# EAGLE design altimetrModul (EAGLE 9.6.2)
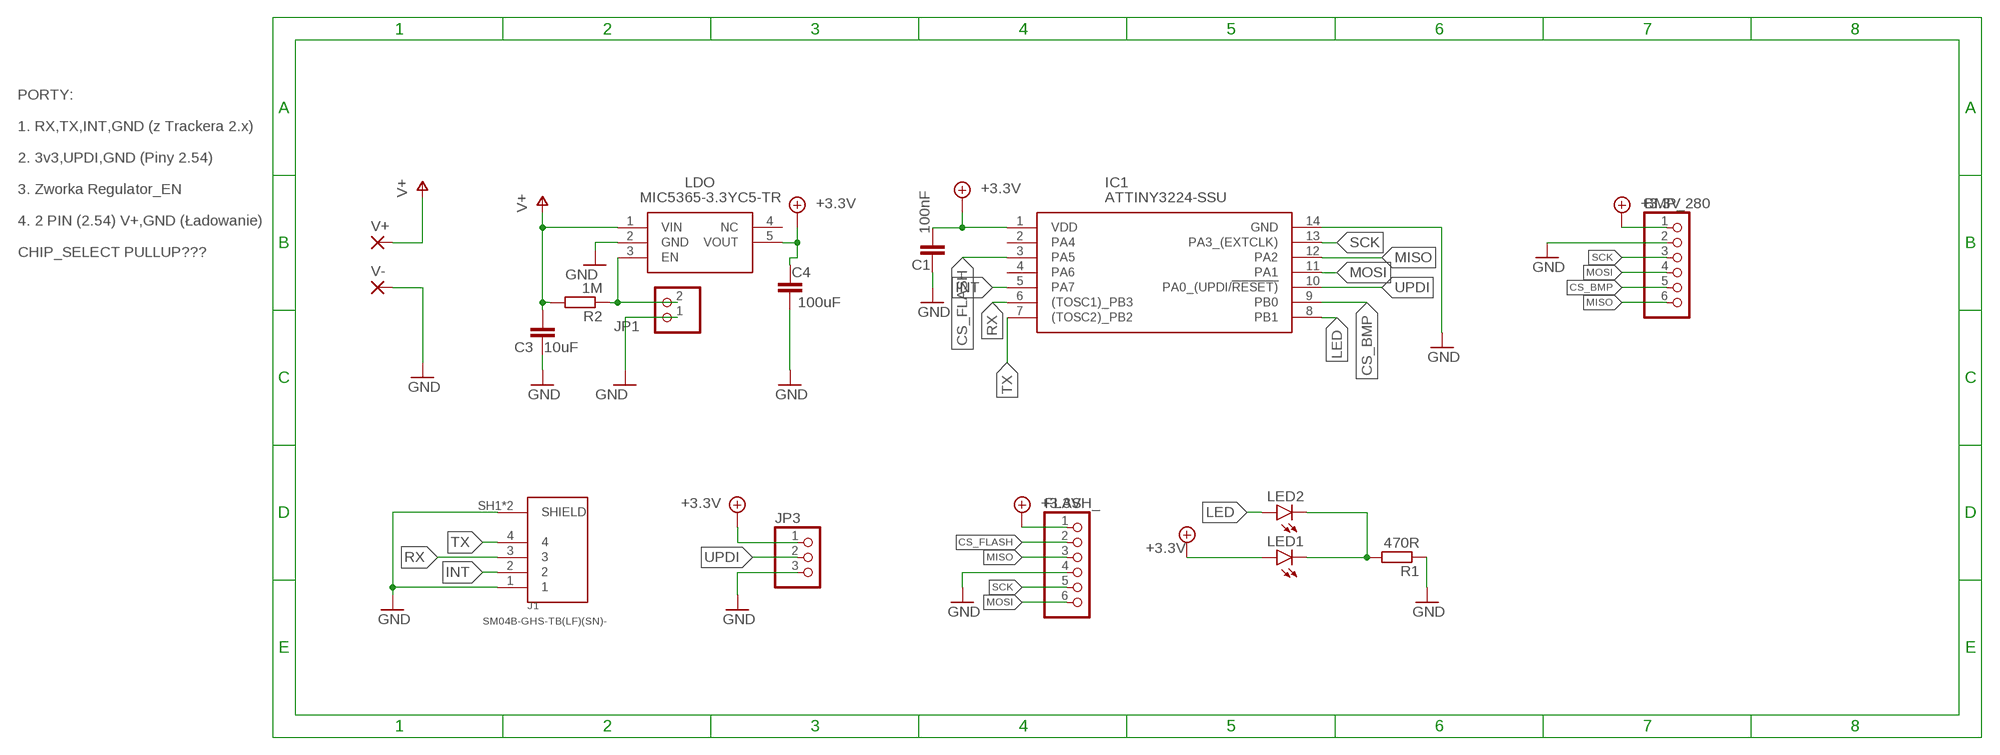
[diagram p0: schematic, sheet 1]

## Parts
BMP_280  PINHD-1X6  [1X06]
C1  100nF  C-EUC0805  [C0805]
C3  10uF  C-EUC0805  [C0805]
C4  100uF  C-EUC0805  [C0805]
FLASH_  PINHD-1X6  [1X06]
IC1  ATTINY3224-SSU  [SOIC127P600X175-14N]
J1  SM04B-GHS-TB(LF)(SN)-  [JST_SM04B-GHS-TB(LF)(SN)-]
JP1  PINHD-1X2/90  [1X02/90]
JP3  PINHD-1X3/90  [1X03/90]
LDO  MIC5365-3.3YC5-TR  [SOT65P210X110-5N]
LED1  LEDCHIP-LED0805  [CHIP-LED0805]
LED2  LEDCHIP-LED0805  [CHIP-LED0805]
R1  470R  R-EU_R0805  [R0805]
R2  1M  R-EU_R0805  [R0805]
V+  SMD2  [SMD1,27-2,54]
V-  SMD2  [SMD1,27-2,54]

## Nets
+3.3V: BMP_280.1 C1.1 C4.2 FLASH_.1 IC1.1(VDD) JP3.1 LDO.5(VOUT) LED1.A
CS_BMP: BMP_280.5 IC1.9(PB0)
CS_FLASH: FLASH_.2 IC1.3(PA5)
EN: JP1.2 LDO.3(EN) R2.1
GND: BMP_280.2 C1.2 C3.1 C4.1 FLASH_.4 IC1.14(GND) J1.1 J1.SH1(SHIELD) J1.SH2(SHIELD) JP1.1 JP3.3 LDO.2(GND) R1.1 V-.1(P)
INT: IC1.5(PA7) J1.2
LED: IC1.8(PB1) LED2.A
MISO: BMP_280.6 FLASH_.3 IC1.12(PA2)
MOSI: BMP_280.4 FLASH_.6 IC1.11(PA1)
N$14: LED1.C LED2.C R1.2
RX: IC1.6((TOSC1)_PB3) J1.3
SCK: BMP_280.3 FLASH_.5 IC1.13(PA3_(EXTCLK))
TX: IC1.7((TOSC2)_PB2) J1.4
UPDI: IC1.10(PA0_(UPDI/!RESET)) JP3.2
V+: C3.2 LDO.1(VIN) R2.2 V+.1(P)
Unconnected: IC1.2(PA4) IC1.4(PA6) LDO.4(NC)

## Notes on the sheet
- PORTY:
  
  1. RX,TX,INT,GND (z Trackera 2.x)
  
  2. 3v3,UPDI,GND (Piny 2.54)
  
  3. Zworka Regulator_EN
  
  4. 2 PIN (2.54) V+,GND (Ładowanie)
  
  CHIP_SELECT PULLUP???

## Library data of the parts
BMP_280 FLASH_ = pinhead:PINHD-1X6: PIN HEADER
C1 C3 C4 = rcl:C-EU: CAPACITOR, European symbol; SPICEPREFIX: C
IC1 = ATTINY3224-SSU:ATTINY3224-SSU: 8-bit Microcontrollers - MCU 20MHz, 32KB, SOIC14, Ind 85C, Green Source: Datasheet <https://ww1.microchip.com/downloads/aemDocuments/documents/MCU08/ProductDocuments/DataSheets/ATtiny3224-3226-3227-Data-Sheet-DS40002345B.pdf>; ARROW_PART_NUMBER: ATTINY3224-SSU; ARROW_PRICE-STOCK: https://www.arrow.com/en/products/attiny3224-ssu/microchip-technology?region=nac; DESCRIPTION: 8-bit Microcontrollers - MCU 20MHz, 32KB, SOIC14, Ind 85C, Green; HEIGHT: 1.75mm; MANUFACTURER_NAME: Microchip; MANUFACTURER_PART_NUMBER: ATTINY3224-SSU; MOUSER_PART_NUMBER: 579-ATTINY3224-SSU; MOUSER_PRICE-STOCK: https://www.mouser.co.uk/ProductDetail/Microchip-Technology-Atmel/ATTINY3224-SSU?qs=A6eO%252BMLsxmTXlQkMmf%252B9gw%3D%3D
J1 = PUTRocketLab_connectors:SM04B-GHS-TB(LF)(SN)-: Conn Header Gh Side 4pos 1.25mm; DESCRIPTION: Connector Header Surface Mount, Right Angle 4 position 0.049 (1.25mm); DIGI-KEY_PART_NUMBER: 455-1566-6-ND; MF: JST Sales; MP: SM04B-GHS-TB(LF)(SN)-; PACKAGE: None; PURCHASE-URL: https://pricing.snapeda.com/search/part/SM04B-GHS-TB(LF)(SN)-/?ref=eda
JP1 = pinhead:PINHD-1X2: PIN HEADER
JP3 = pinhead:PINHD-1X3: PIN HEADER
LDO = MIC5365-3.3YC5-TR:MIC5365-3.3YC5-TR: MICROCHIP - MIC5365-3.3YC5-TR - LDO, FIXED, 3.3V, 0.15A, SC-70-5 Source: Datasheet <http://www.mouser.com/ds/2/268/mic5365-779177.pdf>; ARROW_PART_NUMBER: MIC5365-3.3YC5-TR; ARROW_PRICE-STOCK: https://www.arrow.com/en/products/mic5365-3.3yc5-tr/microchip-technology?region=nac; DESCRIPTION: MICROCHIP - MIC5365-3.3YC5-TR - LDO, FIXED, 3.3V, 0.15A, SC-70-5; HEIGHT: 1.1mm; MANUFACTURER_NAME: Microchip; MANUFACTURER_PART_NUMBER: MIC5365-3.3YC5-TR; MOUSER_PART_NUMBER: 998-MIC5365-3.3YC5TR; MOUSER_PRICE-STOCK: https://www.mouser.co.uk/ProductDetail/Microchip-Technology-Micrel/MIC5365-33YC5-TR?qs=U6T8BxXiZAXvJj%252BPZ%252B301w%3D%3D
LED1 LED2 = led:LED: LED OSRAM: - CHIPLED LG R971, LG N971, LY N971, LG Q971, LY Q971, LO R971, LY R971 LH N974, LH R974 LS Q976, LO Q976, LY Q976 LO Q996 - Hyper CHIPLED LW Q18S LB Q993, LB Q99A, LB R99A - SideLED LS A670, LO A670, LY A670, LG A670, LP A670 LB A673, LV A673, LT A673, LW A673 LH A674 LY A675 LS A676, LA A676, LO A676, LY A676, LW A676 LS A679, LY A679, LG A679 - Hyper Micro SIDELED® LS Y876, LA Y876, LO Y876, LY Y876 LT Y87S - SmartLED LW L88C, LW L88S LB L89C, LB L89S, LG L890 LS L89K, LO L89K, LY L89K LS L896, LA L896, LO L896, LY L896 - TOPLED LS T670, LO T670, LY T670, LG T670, LP T670 LSG T670, LSP T670, LSY T670, LOP T670, LYG T670 LG T671, LOG T671, LSG T671 LB T673, LV T673, LT T673, LW T673 LH T674 LS T676, LA T676, LO T676, LY T676, LB T676, LH T676, LSB T676, LW T676 LB T67C, LV T67C, LT T67C, LS T67K, LO T67K, LY T67K, LW E67C LS E67B, LA E67B, LO E67B, LY E67B, LB E67C, LV E67C, LT E67C LW T67C LS T679, LY T679, LG T679 LS T770, LO T770, LY T770, LG T770, LP T770 LB T773, LV T773, LT T773, LW T773 LH T774 LS E675, LA E675, LY E675, LS T675 LS T776, LA T776, LO T776, LY T776, LB T776 LHGB T686 LT T68C, LB T68C - Hyper Mini TOPLED® LB M676 - Mini TOPLED Santana® LG M470 LS M47K, LO M47K, LY M47K Source: http://www.osram.convergy.de LUXEON: - LUMILED® LXK2-PW12-R00, LXK2-PW12-S00, LXK2-PW14-U00, LXK2-PW14-V00 LXK2-PM12-R00, LXK2-PM12-S00, LXK2-PM14-U00 LXK2-PE12-Q00, LXK2-PE12-R00, LXK2-PE12-S00, LXK2-PE14-T00, LXK2-PE14-U00 LXK2-PB12-K00, LXK2-PB12-L00, LXK2-PB12-M00, LXK2-PB14-N00, LXK2-PB14-P00, LXK2-PB14-Q00 LXK2-PR12-L00, LXK2-PR12-M00, LXK2-PR14-Q00, LXK2-PR14-R00 LXK2-PD12-Q00, LXK2-PD12-R00, LXK2-PD12-S00 LXK2-PH12-R00, LXK2-PH12-S00 LXK2-PL12-P00, LXK2-PL12-Q00, LXK2-PL12-R00 Source: www.luxeon.com KINGBRIGHT: KA-3528ASYC Source: www.kingbright.com
R1 = rcl:R-EU_: RESISTOR, European symbol; SPICEPREFIX: R
R2 = PUTRocketLab_RCL:R-EU_: RESISTOR, European symbol; SPICEPREFIX: R
V+ V- = wirepad:SMD2: SMD PAD

## Board
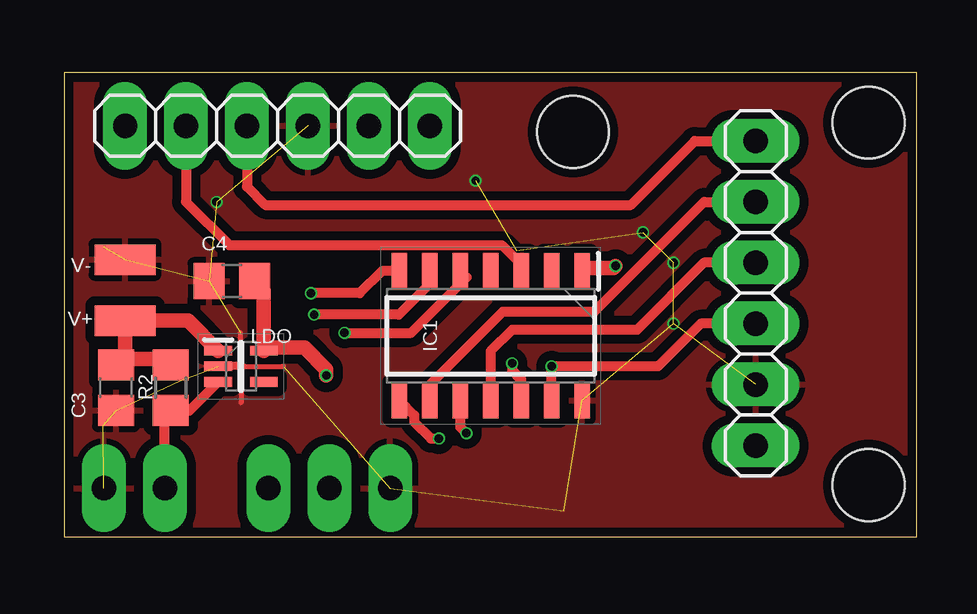
[diagram p1: board, top side]
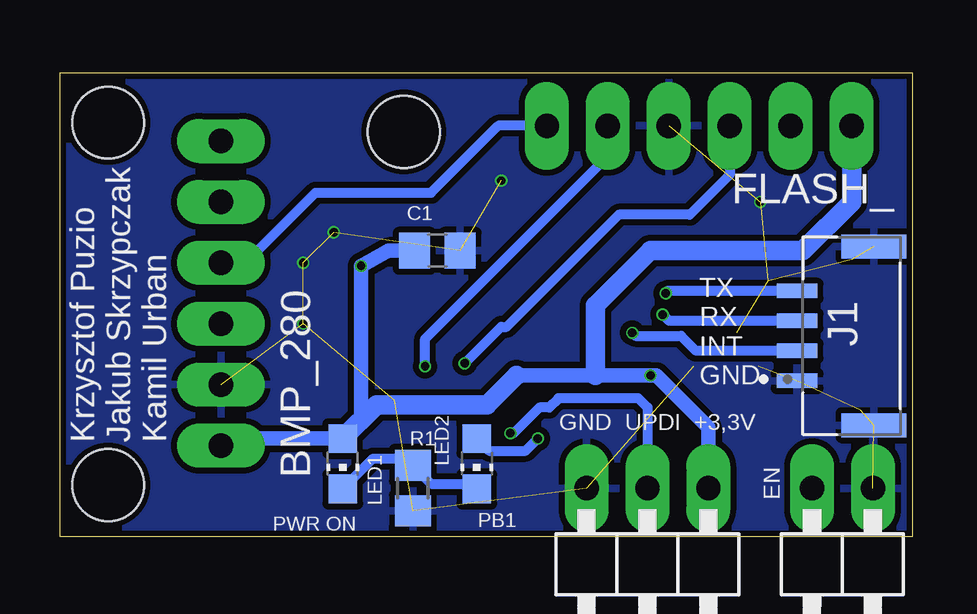
[diagram p2: board, bottom side, seen from below]

Size 35.54 x 19.36 mm. Coordinates in mm from the lower left corner, seen from the top.
Outline: 0,0 35.54,0 35.54,19.36 0,19.36 0,0
Copper layers (1*16): Top 0.035mm / dielectric 1.6mm / Bottom 0.035mm
Design rules "jlcpcb-2layers": minimum track width 5mil, minimum drill 0.3mm, track to track 5mil, track to pad 5mil, pad to pad 5mil, via to via 5mil, smd to smd 5mil, copper to edge 0.2mm, drill to drill 6mil, minimum pad ring 10mil, minimum via ring 3mil, stop-mask expansion 4mil, vias tented up to drill 0mil, thermal gap 10mil
Holes 3 mm at 33.53,17.27 33.53,2.16 21.21,16.89

### Footprints (pad centres in the part's own frame; a part is rotated, then mirrored left to right if it is on the bottom)
1X06 = drill 1.016 long: 1 -6.35,0; 2 -3.81,0; 3 -1.27,0; 4 1.27,0; 5 3.81,0; 6 6.35,0
C0805 = smd 1.3 x 1.5: 1 -0.95,0; 2 0.95,0
SOIC127P600X175-14N = smd 1.5 x 0.65: 1 -2.7,3.81; 2 -2.7,2.54; 3 -2.7,1.27; 4 -2.7,0; 5 -2.7,-1.27; 6 -2.7,-2.54; 7 -2.7,-3.81; 8 2.7,-3.81; 9 2.7,-2.54; 10 2.7,-1.27; 11 2.7,0; 12 2.7,1.27; 13 2.7,2.54; 14 2.7,3.81
JST_SM04B-GHS-TB(LF)(SN)- = smd 0.6 x 1.7: 1 -1.875,2.275; 2 -0.625,2.275; 3 0.625,2.275; 4 1.875,2.275 | smd 1 x 2.7: SH1 -3.725,-0.925; SH2 3.725,-0.925
1X02/90 = drill 1.016 long: 1 -1.27,-3.81; 2 1.27,-3.81
1X03/90 = drill 1.016 long: 1 -2.54,-3.81; 2 0,-3.81; 3 2.54,-3.81
SOT65P210X110-5N = smd 1.15 x 0.4: 1 -0.95,0.65; 2 -0.95,0; 3 -0.95,-0.65; 4 0.95,-0.65; 5 0.95,0.65
CHIP-LED0805 = smd 1.2 x 1.2: A 0,-1.05; C 0,1.05
R0805 = smd 1.3 x 1.5: 1 -0.95,0; 2 0.95,0
SMD1,27-2,54 = smd 1.27 x 2.54: 1 0,0

### Placement (x,y rotation side)
BMP_280  28.83,10.16 90 top
C1  19.81,11.94 0 bottom
C3  2.16,6.22 90 top
C4  6.98,10.67 0 top
FLASH_  8.89,17.14 0 top
IC1  17.78,8.38 270 top
J1  2.54,8.38 90 bottom
JP1  2.92,-1.78 180 bottom
JP3  11.05,-1.78 180 bottom
LDO  7.37,7.11 0 top
LED1  23.75,3.05 180 bottom
LED2  18.16,3.05 180 bottom
R1  20.83,2.03 90 bottom
R2  4.45,6.22 90 top
V+  2.54,9.02 270 top
V-  2.54,11.56 90 top

### Tracks (layer width: path | path; a pad name or v marks a point on that pad's centre or on a via)
+3.3V  (via drill 0.35)
  Top 0.61: IC1.1 21.72,11.21 22.89,11.21 v22.99,11.3 | C4.2 8.32,10.29 LDO.5 8.44,7.89 10.02,7.89 10.92,6.99 v10.92,6.73
  Bottom 0.61: C1.1 21.83,11.94 v22.99,11.3 22.99,4.86 LED1.A 28.54,4.1 BMP_280.1 | 16.51,6.73 13.21,6.73 v10.92,6.73 10.67,6.73 8.51,4.57 JP3.1
  Bottom 0.813: FLASH_.1 2.54,13.97 4.57,11.94 10.92,11.94 13.21,9.65 13.21,6.73 | 16.51,6.73 17.74,5.5 22.35,5.5 LED1.A
CS_BMP
  Top 0.406: IC1.9 15.24,6.35 18.29,9.4 22.1,9.4 26.67,13.97 BMP_280.5
CS_FLASH
  Top 0.406: FLASH_.2 5.08,13.97 6.89,12.16 18.24,12.16 18.97,11.43 19.05,11.43 IC1.3
EN
  Top 0.406: LDO.3 5.23,5.27 R2.1 4.19,5.02 JP1.2
GND  (via drill 0.35)  (18 unrouted)
  Top 0.2: 7.37,7.11 9.14,7.11
  Top 0.203: 6.98,7.11 6.98,7.21 7.35,7.21 7.35,8.51 | 7.37,7.11 7.37,5.59
  Top 0.254: LDO.2 6.98,7.11 7.37,7.11
  other vias: 17.14,14.86 6.35,13.97 25.4,11.43 25.4,8.89 24.13,12.7
  pour Top (isolate 0.381): -0.51,0 36.83,0 36.83,26.54 -0.51,26.54
  pour Bottom (isolate 0.254): 0,22.86 36.83,25.4 36.83,-2.54 0,-2.54
INT  (via drill 0.35)
  Top 0.406: IC1.5 16.77,10.82 14.46,8.51 v11.68,8.51
  Bottom 0.406: J1.2 9.03,7.76 9.65,8.38 11.56,8.38 v11.68,8.51
LED  (via drill 0.35)
  Top 0.406: IC1.8 14.58,5.07 14.58,4.79 15.28,4.1 v15.62,4.1
  Bottom 0.406: LED2.A 17.65,3.59 16.13,3.59 v15.62,4.1
MISO  (via drill 0.35)
  Top 0.406: v18.67,7.24 18.67,6.95 19.05,6.57 IC1.12 | FLASH_.3 7.62,14.61 8.38,13.84 23.62,13.84 26.29,16.51 BMP_280.6
  Bottom 0.406: FLASH_.3 7.62,15.11 9.29,13.44 12.24,13.44 16.92,8.76 17.14,8.76 v18.67,7.24
MOSI
  Top 0.406: BMP_280.4 26.67,11.43 23.88,8.64 18.67,8.64 17.78,7.75 IC1.11
  Bottom 0.406: BMP_280.4 27.8,11.43 24.88,14.35 20.07,14.35 17.27,17.14 FLASH_.6
N$14
  Bottom 0.406: LED2.C 18.16,2.22 20.07,2.22 R1.2 21.11,3.27 22.48,3.27 LED1.C
RX  (via drill 0.35)
  Top 0.406: IC1.6 15.24,10.56 13.96,9.27 v10.41,9.27
  Bottom 0.406: J1.3 10.15,9.01 v10.41,9.27
SCK  (via drill 0.35)
  Top 0.406: IC1.13 v20.32,7.11 24.76,7.11 26.54,8.89 BMP_280.3
  Bottom 0.406: v20.32,7.11 20.32,8.26 12.7,15.88 FLASH_.5
TX  (via drill 0.35)
  Top 0.406: IC1.7 13.24,11.08 12.32,10.16 v10.29,10.16
  Bottom 0.406: J1.4 10.19,10.26 v10.29,10.16
UPDI  (via drill 0.35)
  Top 0.406: v16.76,4.32 16.51,4.57 IC1.10
  Bottom 0.406: v16.76,4.32 16.64,4.32 15.56,5.4 15.15,5.4 14.76,5.78 11.43,5.78 11.05,5.4 JP3.2
V+
  Top 0.61: R2.2 4.19,7.43 2.41,7.43 2.54,7.55 V+.1 5.16,9.02 LDO.1
  Top 0.813: 2.41,7.43 C3.2

### Text on the board
bNames: TX / RX / INT / GND | GND UPDI +3,3V | Krzysztof Puzio / Jakub Skrzypczak / Kamil Urban | EN | PB1 | PWR ON